# EAGLE schematic BATT_DCDC (EAGLE 9.6.2)
COMPANY: ADAFRUIT INDUSTRIES; DRAWN: KTOWN; REV: B
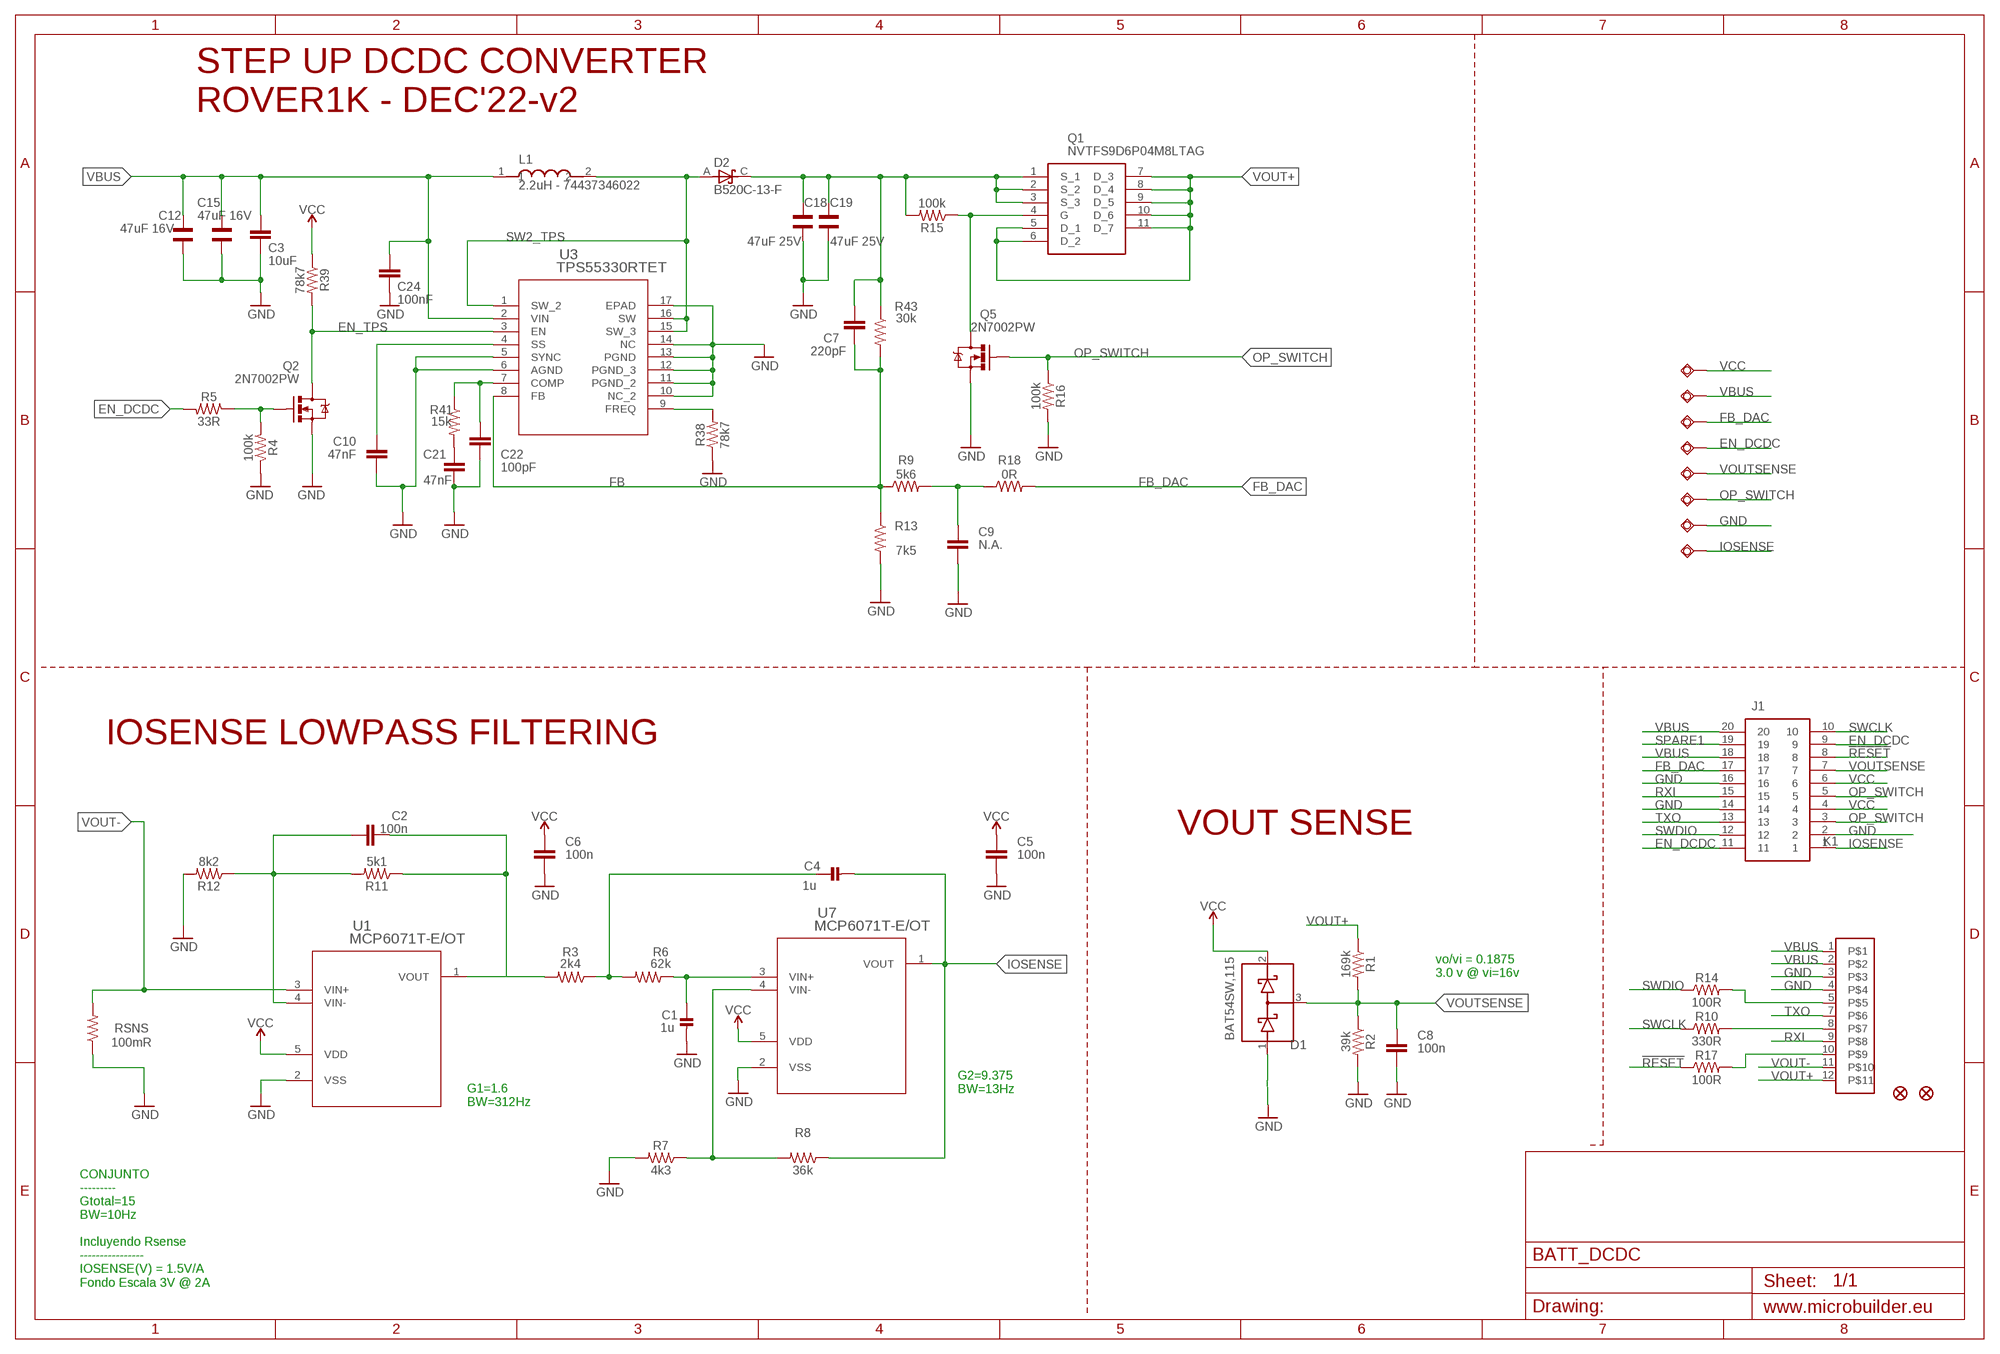
[diagram p0: schematic, sheet 1]

## Parts
C1  1u  CAP_CERAMIC0603_NO  [0603-NO]
C2  100n  0.1UF-0603-25V-(+80/-20%)  [0603]
C3  10uF  10UF-0805-10V-10%  [0805]
C4  1u  CAP_CERAMIC0603_NO  [0603-NO]
C5  100n  0.1UF-0603-25V-(+80/-20%)  [0603]
C6  100n  0.1UF-0603-25V-(+80/-20%)  [0603]
C7  220pF  270PF-0603-50V-5%  [0603]
C8  100n  0.1UF-0603-25V-(+80/-20%)  [0603]
C9  N.A.  0.1UF-0603-25V-(+80/-20%)  [0603]
C10  47nF  47NF-0603-25V-5%  [0603]
C12  47uF 16V  WCAP-CSGP_1210_885012109003  [WCAP-CSGP_1210]
C15  47uF 16V  WCAP-CSGP_1210_885012109003  [WCAP-CSGP_1210]
C18  47uF 25V  WCAP-CSGP_1210_885012109003  [WCAP-CSGP_1210]
C19  47uF 25V  WCAP-CSGP_1210_885012109003  [WCAP-CSGP_1210]
C21  47nF  2.2NF/2200PF-0603-50V-10%  [0603]
C22  100pF  270PF-0603-50V-5%  [0603]
C24  100nF  0.1UF-0603-25V-(+80/-20%)  [0603]
D1  BAT54SW,115  [SOT65P210X110-3N]
D2  B520C-13-F  [DIOM7959X250N]
EN_DCDC  TESTPAD_TPSQB1,27  [TESTPAD_B1,27]
FB_DAC  TESTPAD_TPSQB1,27  [TESTPAD_B1,27]
GND  TESTPAD_TPSQB1,27  [TESTPAD_B1,27]
IOSENSE  TESTPAD_TPSQB1,27  [TESTPAD_B1,27]
J1  DF40C-20DP-0.4V_51_  [DF40C-20DPA]
K1  FLEX11  [FLEX11]
L1  2.2uH - 74437346022  74437349100  [INDM7366X500]
OP_SWITCH  TESTPAD_TPSQB1,27  [TESTPAD_B1,27]
Q1  NVTFS9D6P04M8LTAG  [NVTFS5124PLTWG]
Q2  2N7002PW  MOSFET-NCHANNEL2N7002PW  [SOT323]
Q5  2N7002PW  MOSFET-NCHANNEL2N7002PW  [SOT323]
R1  169k  RESISTOR0402  [0402]
R2  39k  RESISTOR0402  [0402]
R3  2k4  RESISTOR0603  [0603]
R4  100k  RESISTOR0402  [0402]
R5  33R  RESISTOR0402  [0402]
R6  62k  RESISTOR0603  [0603]
R7  4k3  RESISTOR0603  [0603]
R8  36k  RESISTOR0603  [0603]
R9  5k6  RESISTOR0402  [0402]
R10  330R  RESISTOR0402  [0402]
R11  5k1  RESISTOR0402  [0402]
R12  8k2  RESISTOR0402  [0402]
R13  7k5  RESISTOR0402  [0402]
R14  100R  RESISTOR0402  [0402]
R15  100k  RESISTOR0402  [0402]
R16  100k  RESISTOR0402  [0402]
R17  100R  RESISTOR0402  [0402]
R18  0R  RESISTOR0402  [0402]
R38  78k7  RESISTOR0402  [0402]
R39  78k7  RESISTOR0402  [0402]
R41  15k  RESISTOR0402  [0402]
R43  30k  RESISTOR0402  [0402]
RSNS  100mR  RESISTOR1206  [1206]
U1  MCP6071T-E/OT  [SOT-23-5_MC_MCH]
U3  TPS55330RTET  [RTE16_1P66X1P66_TEX]
U7  MCP6071T-E/OT  [SOT-23-5_MC_MCH]
U$1  FIDUCIAL""  [FIDUCIAL_1MM]
U$2  FIDUCIAL""  [FIDUCIAL_1MM]
VBUS  TESTPAD_TPSQB1,27  [TESTPAD_B1,27]
VCC  TESTPAD_TPSQB1,27  [TESTPAD_B1,27]
VOUTSENSE  TESTPAD_TPSQB1,27  [TESTPAD_B1,27]

## Nets
!RESET: J1.8 R17.1
COMP_TPS: C22.2 R41.1 U3.7(COMP)
EN_DCDC: EN_DCDC.TP J1.9 J1.11 R5.2
EN_TPS: Q2.3(D) R39.2 U3.3(EN)
FB: C7.1 R9.1 R13.1 R43.2 U3.8(FB)
FB_DAC: FB_DAC.TP J1.17 R18.2
FREQ_TPS: R38.2 U3.9(FREQ)
GND: C1.2 C3.1 C5.2 C6.2 C8.2 C9.2 C10.2 C12.1 C15.1 C18.1 C19.1 C21.1 C22.1 C24.1 D1.1(A) GND.TP J1.2 J1.14 J1.16 K1.3 K1.4 Q2.2(S) Q5.2(S) R2.2 R4.1 R7.2 R12.2 R13.2 R16.2 R38.1 RSNS.1 U1.2(VSS) U3.5(SYNC) U3.6(AGND) U3.10(NC_2) U3.11(PGND_2) U3.12(PGND_3) U3.13(PGND) U3.14(NC) U3.17(EPAD) U7.2(VSS)
IOSENSE: C4.2 IOSENSE.TP J1.1 R8.1 U7.1(VOUT)
ISENSE_RAW: C2.1 R3.2 R11.1 U1.1(VOUT)
N$1: C2.2 R11.2 R12.1 U1.4(VIN-)
N$2: R7.1 R8.2 U7.4(VIN-)
N$3: C4.1 R3.1 R6.2
N$4: Q2.1(G) R4.2 R5.1
N$5: C1.1 R6.1 U7.3(VIN+)
N$6: K1.8 R10.2
N$8: Q1.4(G) Q5.3(D) R15.1
N$10: K1.10 R17.2
N$11: K1.5 R14.2
N$12: C9.1 R9.2 R18.1
N$35: C10.1 U3.4(SS)
N$43: C21.2 R41.2
OP_SWITCH: J1.3 J1.5 OP_SWITCH.TP Q5.1(G) R16.1
RXI: J1.15 K1.9
SPARE1: J1.19
SW2_TPS: D2.A L1.2 U3.1(SW_2) U3.15(SW_3) U3.16(SW)
SWCLK: J1.10 R10.1
SWDIO: J1.12 R14.1
TXO: J1.13 K1.7
VBUS: C3.2 C12.2 C15.2 C24.2 J1.18 J1.20 K1.1 K1.2 L1.1 U3.2(VIN) VBUS.TP
VCC: C5.1 C6.1 D1.2(C) J1.4 J1.6 R39.1 U1.5(VDD) U7.5(VDD) VCC.TP
VOUT+: K1.12 Q1.5(D_1) Q1.6(D_2) Q1.7(D_3) Q1.8(D_4) Q1.9(D_5) Q1.10(D_6) Q1.11(D_7) R1.1
VOUT-: K1.11 RSNS.2 U1.3(VIN+)
VOUTSENSE: C8.1 D1.3(A-C) J1.7 R1.2 R2.1 VOUTSENSE.TP
VSOURCE: C7.2 C18.2 C19.2 D2.C Q1.1(S_1) Q1.2(S_2) Q1.3(S_3) R15.2 R43.1

## Notes on the sheet
- STEP UP DCDC CONVERTER
  ROVER1K - DEC'22-v2
- IOSENSE LOWPASS FILTERING
- VOUT SENSE
- vo/vi = 0.1875
  3.0 v @ vi=16v
- G2=9.375
  BW=13Hz
- G1=1.6
  BW=312Hz
- CONJUNTO
  ---------
  Gtotal=15
  BW=10Hz
  
  Incluyendo Rsense
  ----------------
  IOSENSE(V) = 1.5V/A
  Fondo Escala 3V @ 2A

## Library data of the parts
C1 C4 = microbuilder:CAP_CERAMIC: Ceramic Capacitors For new designs, use the packages preceded by an '_' character since they are more reliable: The following footprints should be used on most boards: _0402 - Standard footprint for regular board layouts _0603 - Standard footprint for regular board layouts _0805 - Standard footprint for regular board layouts _1206 - Standard footprint for regular board layouts For extremely tight-pitch boards where space is at a premium, the following 'micro-pitch' footprints can be used (smaller pads, no silkscreen outline, etc.): _0402MP - Micro-pitch footprint for very dense/compact boards _0603MP - Micro-pitch footprint for very dense/compact boards _0805MP - Micro-pitch footprint for very dense/compact boards _1206MP - Micro-pitch footprint for very dense/compact boards
C2 C5 C6 C8 C9 C24 = SparkFun-Capacitors:0.1UF: 0.1µF ceramic capacitors A capacitor is a passive two-terminal electrical component used to store electrical energy temporarily in an electric field.; PROD_ID: CAP-00810; VALUE: 0.1uF
C3 = SparkFun-Capacitors:10UF: 10.0µF ceramic capacitors A capacitor is a passive two-terminal electrical component used to store electrical energy temporarily in an electric field.; PROD_ID: CAP-11330
C7 C22 = SparkFun-Capacitors:270PF: 270pF/0.27nF ceramic capacitors A capacitor is a passive two-terminal electrical component used to store electrical energy temporarily in an electric field.; PROD_ID: CAP-13339; VALUE: 270PF
C10 = SparkFun-Capacitors:47NF: 47nF ceramic capacitors A capacitor is a passive two-terminal electrical component used to store electrical energy temporarily in an electric field.; PROD_ID: CAP-08605
C12 C15 C18 C19 = Wurth_Elektronik_Passive_Capacitors_rev19a:WCAP-CSGP_1210: WCAP-CSGP Ceramic Capacitors Characteristics Multilayer Ceramic Chip Capacitor Recommended soldering:Reflow, for 0603 and 0805 wave soldering is also allowed Operating temperature:-55 °C to +125 °C; Ceramic characteristics: Class I - NPO ; Class II -X7R, X5R High performance ceramic High capacitance stability Minimal aging Termination:Cu/Ni/Sn <http://katalog.we-online.de/media/images/eisos/WCAP-CSGP_pf2.jpg> Details see: http://katalog.we-online.de/en/pbs/WCAP-CSGP-1210? Created: 2015-01-28 2015 (C) Wurth Elektronik; WE-NUMBER: 885012109003/47uF
C21 = SparkFun-Capacitors:2.2NF/2200PF: 2.2nF/2,200pF ceramic capacitors A capacitor is a passive two-terminal electrical component used to store electrical energy temporarily in an electric field.; PROD_ID: CAP-07877; VALUE: 2.2nF
D1 = BAT54SW_115:BAT54SW,115: BAT54W Series 30 V 600 mA SMT Schottky Barrier Double Diode -SOT-323 Check availability <https://pricing.snapeda.com/parts/BAT54SW%2C115/Nexperia%20USA%20Inc./view-part?ref=eda>; AVAILABILITY: In Stock; DESCRIPTION: Diode Array 1 Pair Series Connection Schottky 30 V 200mA (DC) Surface Mount SC-70, SOT-323; MF: Nexperia USA Inc.; MP: BAT54SW,115; PACKAGE: SOT-323 Nexperia USA Inc.; PRICE: None; PURCHASE-URL: https://pricing.snapeda.com/search/part/BAT54SW,115/?ref=eda
D2 = B520C-13-F:B520C-13-F: 5.0A SURFACE MOUNT SCHOTTKY BARRIER RECTIFIER; AVAILABILITY: Unavailable; DESCRIPTION: Diode Schottky 20V 5A Surface Mount SMC; DIGIKEY-PURCHASE-URL: https://snapeda.com/shop?store=DigiKey&id=325969; MF: Diodes Inc.; MP: B520C-13-F; PACKAGE: DO-214 Diodes Inc.; PRICE: None
EN_DCDC FB_DAC GND IOSENSE OP_SWITCH VBUS VCC VOUTSENSE = BeagleBone_Blue_R3:TESTPAD_TPSQ: Test pad
J1 = DF40C-20DP-0.4V_51_:DF40C-20DP-0.4V_51_: HIROSE(HRS) - DF40C-20DP-0.4V(51) - CONNECTOR, STACKING, HEADER, 20POS, 2ROW Source: Datasheet <https://datasheet.datasheetarchive.com/originals/distributors/Datasheets-DGA17/1059795.pdf>; ARROW_PART_NUMBER: DF40C-20DP-0.4V(51); ARROW_PRICE-STOCK: https://www.arrow.com/en/products/df40c-20dp-0.4v-51/hirose-electric; DESCRIPTION: HIROSE(HRS) - DF40C-20DP-0.4V(51) - CONNECTOR, STACKING, HEADER, 20POS, 2ROW; HEIGHT: mm; MANUFACTURER_NAME: Hirose; MANUFACTURER_PART_NUMBER: DF40C-20DP-0.4V(51); MOUSER_PART_NUMBER: 798-DF40C20DP0.4V51; MOUSER_PRICE-STOCK: https://www.mouser.co.uk/ProductDetail/Hirose-Connector/DF40C-20DP-0.4V51?qs=eDUdFcBPps31lPFyZ%252BXRFg%3D%3D
K1 = Flex_3mm:FLEX11
L1 = Inductance_2.2uH:74437349100: Inductor, SMD [Würth Elektronik] 74437349100 Inductor, SMD; DESCRIPTION: 10µH Shielded Molded Inductor 3.2A 69mOhm Max Nonstandard; DIGIKEY-PURCHASE-URL: https://snapeda.com/shop?store=DigiKey&id=586788; MF: Wurth Electronics; MP: 74437349100; PACKAGE: Nonstandard Wurth Electronics
Q1 = SamacSys_Parts:NVTFS9D6P04M8LTAG: MOSFET MV8 P INITIAL PROGRAM Source: Datasheet <https://www.onsemi.com/pub/Collateral/NVTFS9D6P04M8L-D.PDF>; DESCRIPTION: MOSFET MV8 P INITIAL PROGRAM; HEIGHT: 0.8mm; MANUFACTURER_NAME: ON Semiconductor; MANUFACTURER_PART_NUMBER: NVTFS9D6P04M8LTAG; MOUSER_PART_NUMBER: 863-NVTFS9D6P04M8LTG; MOUSER_PRICE-STOCK: https://www.mouser.co.uk/ProductDetail/ON-Semiconductor/NVTFS9D6P04M8LTAG/?qs=xZ%2FP%252Ba9zWqYALd8g5rll2Q%3D%3D
Q2 Q5 = SparkFun-DiscreteSemi:MOSFET-NCHANNEL: Common NMOSFET Parts MFG P/N Store ID Prod ID FDD8780 TRANS-09984 SI7820DN TRANS-11055 FDS6630A IC-08089 2N7002PW TRANS-11151 FQP30N06L COM-10213 TRANS-10060 BSS123LT1G TRANS-08345 BSS138 TRANS-00830 BS170 2N7000; PROD_ID: TRANS-11151
R1-R18 R38 R39 R41 R43 RSNS = SparkFun-Resistors:RESISTOR: Generic Resistor Package
U1 U7 = MCP6071:MCP6071T-E/OT; BUILT_BY: EMA_Jessica; COPYRIGHT: Copyright (C) 2018 Accelerated Designs. All rights reserved; MANUFACTURER_PART_NUMBER: MCP6071T-E/OT; SOURCELIBRARY: Microchip_2019-08-23_21; VENDOR: Microchip
U3 = TPS55330:TPS55330RTET; BUILT_BY: EMA_UL_Team; MANUFACTURER_PART_NUMBER: TPS55330RTET; SOURCELIBRARY: TI_2015-1-5; VENDOR: Texas Instruments
U$1 U$2 = microbuilder:FIDUCIAL: Fiducial Alignment Points Various fiducial points for machine vision alignment.; BOM: EXCLUDE

## Net classes
2 gnd: width 0.305 mm, drill 0.483 mm, clearance 0.203 mm